# EAGLE design doom-card (EAGLE 9.5.2)
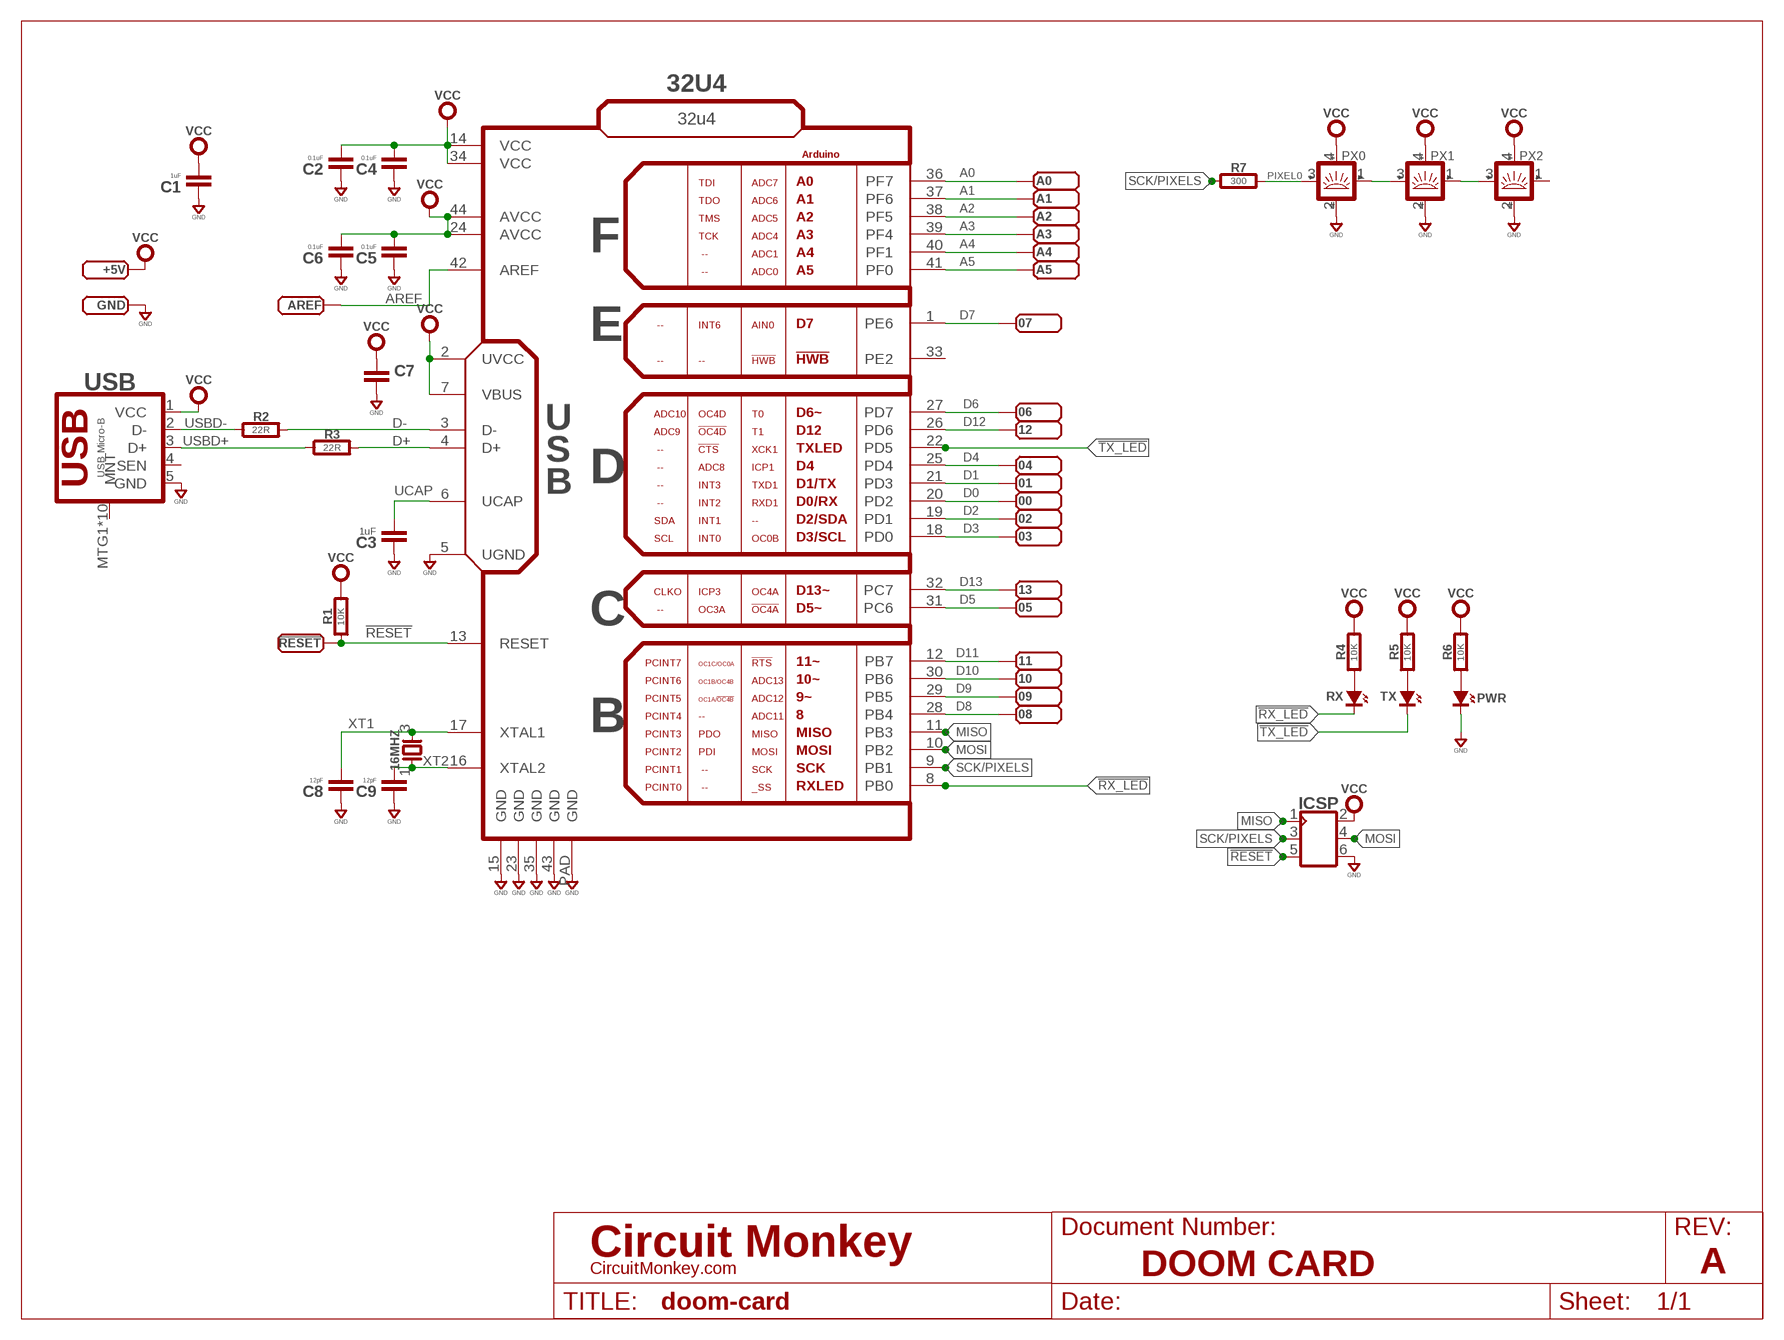
[diagram p0: schematic, sheet 1]
U$1 (LETTER_L-CIRCUITMONKEY): DOCUMENT_NUMBER: DOOM CARD; REV: A

## Parts
00  PADSMD-100X100  [SMD-100X100]
01  PADSMD-100X100  [SMD-100X100]
02  PADSMD-100X100  [SMD-100X100]
03  PADSMD-100X100  [SMD-100X100]
04  PADSMD-100X100  [SMD-100X100]
05  PADSMD-100X100  [SMD-100X100]
06  PADSMD-100X100  [SMD-100X100]
07  PADSMD-100X100  [SMD-100X100]
08  PADSMD-100X100  [SMD-100X100]
09  PADSMD-100X100  [SMD-100X100]
10  PADSMD-100X100  [SMD-100X100]
11  PADSMD-100X100  [SMD-100X100]
12  PADSMD-100X100  [SMD-100X100]
13  PADSMD-100X100  [SMD-100X100]
16MHZ  SMD-4P3X5  [ABRACON_ABM3C]
32U4  32u4  ATMEGA32U4  [QFN50P700X700X100-44]
!RESET  PADSMD-100X100  [SMD-100X100]
+5V  PADSMD-100X100  [SMD-100X100]
A0  PADSMD-100X100  [SMD-100X100]
A1  PADSMD-100X100  [SMD-100X100]
A2  PADSMD-100X100  [SMD-100X100]
A3  PADSMD-100X100  [SMD-100X100]
A4  PADSMD-100X100  [SMD-100X100]
A5  PADSMD-100X100  [SMD-100X100]
AREF  PADSMD-100X100  [SMD-100X100]
C1  1uF  CAPACITOR0402  [0402-CAP]
C2  0.1uF  CAPACITOR0402  [0402-CAP]
C3  1uF  CAPACITOR0402  [0402-CAP]
C4  0.1uF  CAPACITOR0402  [0402-CAP]
C5  0.1uF  CAPACITOR0402  [0402-CAP]
C6  0.1uF  CAPACITOR0402  [0402-CAP]
C7  CAPACITOR0603  [0603-CAP]
C8  12pF  CAPACITOR0402  [0402-CAP]
C9  12pF  CAPACITOR0402  [0402-CAP]
GND  PADSMD-100X100  [SMD-100X100]
ICSP  CON_03X2-VT_SMD  [MA03X2-VT-SMD]
PWR  SMT0402  [SMD_0402]
PX0  SMART_LED3535  [SMD_3535]
PX1  SMART_LED3535  [SMD_3535]
PX2  SMART_LED3535  [SMD_3535]
R1  10K  RESISTOR0402  [0402-RES]
R2  22R  RESISTOR0402  [0402-RES]
R3  22R  RESISTOR0402  [0402-RES]
R4  10K  RESISTOR0402  [0402-RES]
R5  10K  RESISTOR0402  [0402-RES]
R6  10K  RESISTOR0402  [0402-RES]
R7  300  RESISTOR0402  [0402-RES]
RX  SMT0402  [SMD_0402]
TX  SMT0402  [SMD_0402]
USB  USB Micro-B  USB-B-MICRO-SMTJAE-DX4R005  [JAE-DX4R005]

## Nets
!RESET: 32U4.13(RESET) !RESET.PAD ICSP.5 R1.1
!RX_LED: 32U4.8(PB0) RX.K(C)
!TX_LED: 32U4.22(PD5) TX.K(C)
A0: 32U4.36(PF7) A0.PAD
A1: 32U4.37(PF6) A1.PAD
A2: 32U4.38(PF5) A2.PAD
A3: 32U4.39(PF4) A3.PAD
A4: 32U4.40(PF1) A4.PAD
A5: 32U4.41(PF0) A5.PAD
AREF: 32U4.42(AREF) AREF.PAD
D0: 00.PAD 32U4.20(PD2)
D1: 01.PAD 32U4.21(PD3)
D2: 02.PAD 32U4.19(PD1)
D3: 03.PAD 32U4.18(PD0)
D4: 04.PAD 32U4.25(PD4)
D5: 05.PAD 32U4.31(PC6)
D6: 06.PAD 32U4.27(PD7)
D7: 07.PAD 32U4.1(PE6)
D8: 08.PAD 32U4.28(PB4)
D9: 09.PAD 32U4.29(PB5)
D10: 10.PAD 32U4.30(PB6)
D11: 11.PAD 32U4.12(PB7)
D12: 12.PAD 32U4.26(PD6)
D13: 13.PAD 32U4.32(PC7)
D+: 32U4.4(D+) R3.2
D-: 32U4.3(D-) R2.2
GND: 32U4.5(UGND) 32U4.15(GND) 32U4.23(GND) 32U4.35(GND) 32U4.43(GND) 32U4.PAD(GND) C1.1 C2.1 C3.1 C4.1 C5.1 C6.1 C7.2 C8.1 C9.1 GND.PAD ICSP.6 PWR.K(C) PX0.2(GND) PX1.2(GND) PX2.2(GND) USB.5(GND)
MISO: 32U4.11(PB3) ICSP.1
MOSI: 32U4.10(PB2) ICSP.4
N$9: R4.1 RX.A
N$10: R5.1 TX.A
N$11: PWR.A R6.1
N$12: PX0.1(OUT) PX1.3(IN)
N$13: PX1.1(OUT) PX2.3(IN)
PIXEL0: PX0.3(IN) R7.2
SCK/PIXELS: 32U4.9(PB1) ICSP.3 R7.1
UCAP: 32U4.6(UCAP) C3.2
USBD+: R3.1 USB.3(D+)
USBD-: R2.1 USB.2(D-)
VCC: 32U4.2(UVCC) 32U4.7(VBUS) 32U4.14(VCC) 32U4.24(AVCC) 32U4.34(VCC) 32U4.44(AVCC) +5V.PAD C1.2 C2.2 C4.2 C5.2 C6.2 C7.1 ICSP.2 PX0.4(VDD) PX1.4(VDD) PX2.4(VDD) R1.2 R4.2 R5.2 R6.2 USB.1(VCC)
XT1: 16MHZ.3 32U4.17(XTAL1) C8.2
XT2: 16MHZ.1 32U4.16(XTAL2) C9.2
Unconnected: 32U4.33(PE2) PX2.1(OUT) USB.4(SEN) USB.MTG1(MNT) USB.MTG2(MNT) USB.MTG3(MNT) USB.MTG4(MNT) USB.MTG5(MNT) USB.MTG6(MNT) USB.MTG7(MNT) USB.MTG8(MNT) USB.MTG9(MNT) USB.MTG10(MNT)

## Power pins joined to a net without a drawn wire
GND: 16MHZ.2(GND) 16MHZ.4(GND)

## Library data of the parts
00 01-09 10-13 !RESET +5V A0 A1-A5 AREF GND = con-testpoints:PAD: Solder Pad
16MHZ = xtal:SMD-4P
32U4 = atmel-atmega:ATMEGA32U4: ATMEGA 32U4
C1-C9 = rlc:CAPACITOR: Capacitor CAP
ICSP = con-headers:CON_03X2: Header, 3x2 (6-pin)
PWR RX TX = led:SMT: LED SMT
PX0 PX1 PX2 = led:SMART_LED: Smart LED SK6812 WS2812
R1-R7 = rlc:RESISTOR: Resistor
USB = con-usb:USB-B-MICRO-SMT: USB Micro - B-style; MFR: JAE; MPN: DX4R005JJ2R1800; OC_MOUSER: https://www.mouser.com/ProductDetail/DX4R005JJ2R1800

## Board
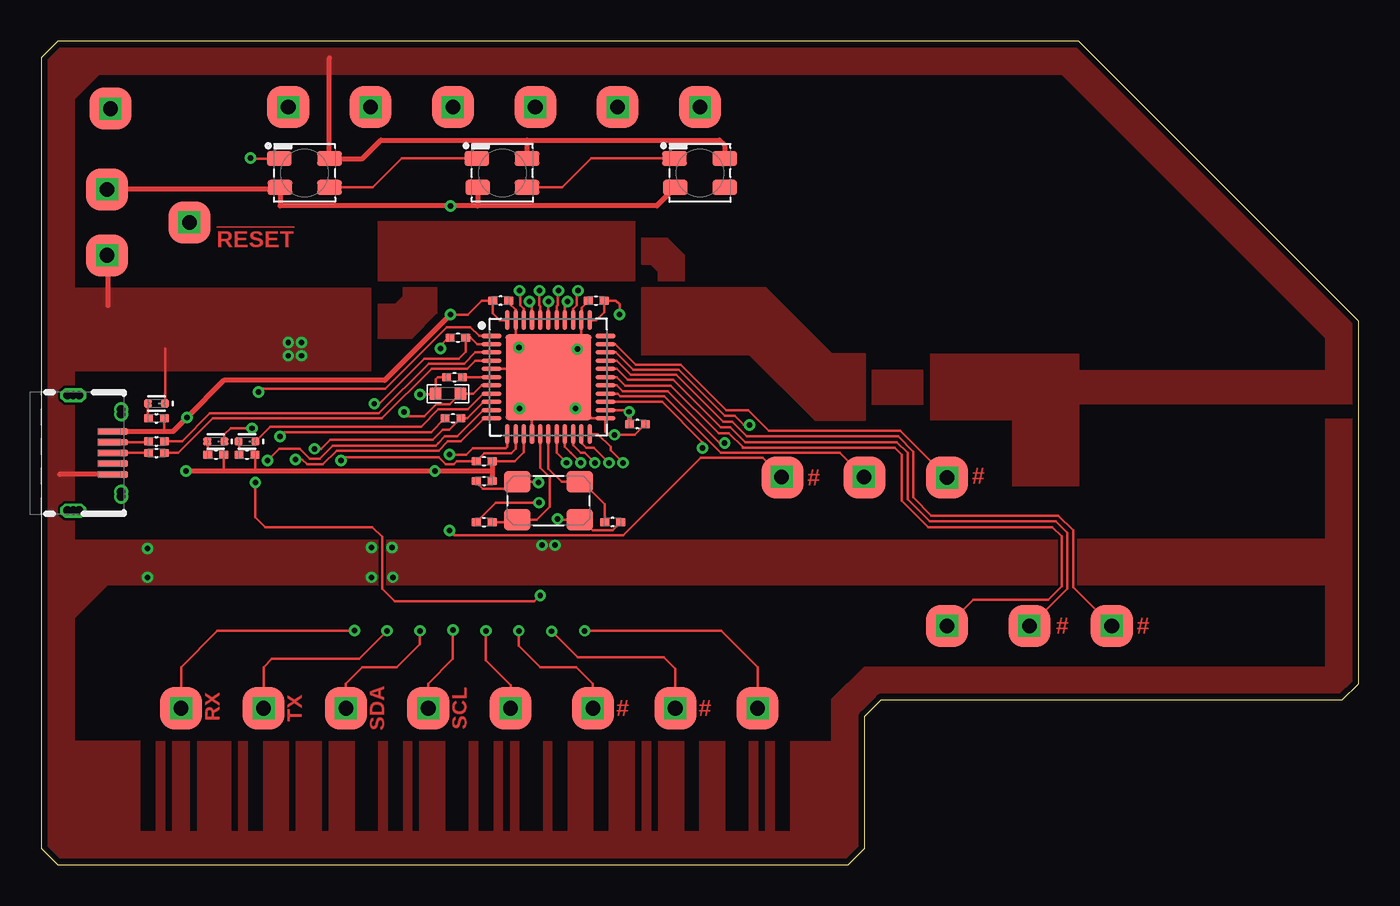
[diagram p1: board, top side]
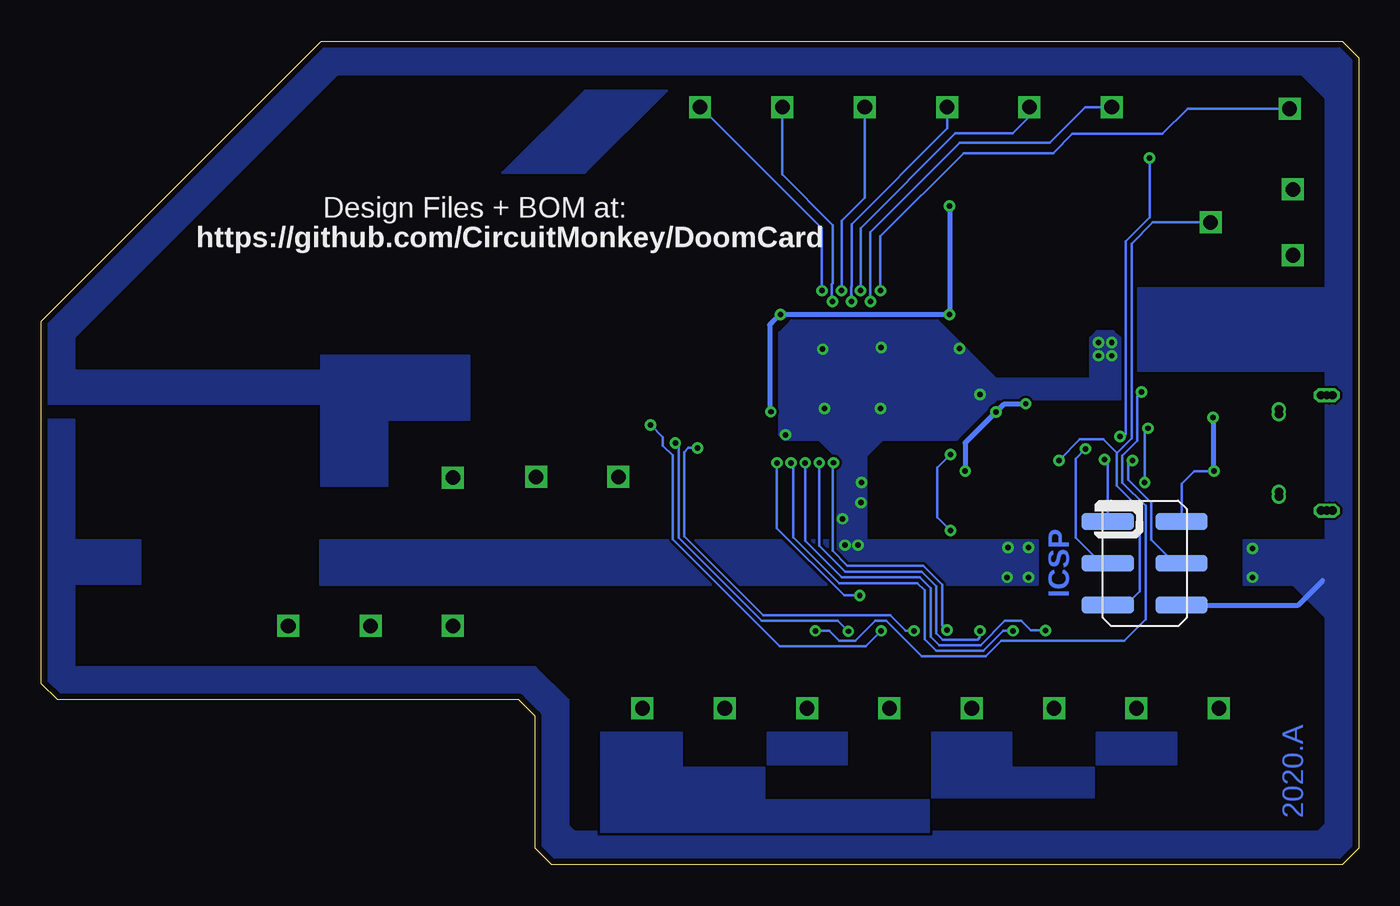
[diagram p2: board, bottom side, seen from below]

Size 80 x 50 mm. Coordinates in mm from the lower left corner, seen from the top.
Outline: 1,0 49,0 50,1 50,9 51,10 79,10 80,11 80,33 63,50 1,50 0,49 0,1 1,0
Copper layers (1*16): Top 0.0356mm / dielectric 1.5011mm / Bottom 0.0356mm
Design rules "OSH-CircuitMonkey": minimum track width 6mil, minimum drill 13mil, track to track 6mil, track to pad 6mil, pad to pad 6mil, via to via 6mil, smd to smd 6mil, copper to edge 15mil, drill to drill 6mil, minimum pad ring 7mil, minimum via ring 7mil, stop-mask expansion 3mil, vias tented up to drill 13mil, thermal gap 10mil

### Footprints (pad centres in the part's own frame; a part is rotated, then mirrored left to right if it is on the bottom)
SMD-100X100 = smd 2.54 x 2.54: PAD 0,0
ABRACON_ABM3C = smd 1.6 x 1.3: 1 -1.9,-1.15; 2 1.9,-1.15; 3 1.9,1.15; 4 -1.9,1.15
QFN50P700X700X100-44 = smd 1.2 x 0.264: 1 -3.46,2.5; 2 -3.46,2; 3 -3.46,1.5; 4 -3.46,1; 5 -3.46,0.5; 6 -3.46,0; 7 -3.46,-0.5; 8 -3.46,-1; 9 -3.46,-1.5; 10 -3.46,-2; 11 -3.46,-2.5; 23 3.46,-2.5; 24 3.46,-2; 25 3.46,-1.5; 26 3.46,-1; 27 3.46,-0.5; 28 3.46,0; 29 3.46,0.5; 30 3.46,1; 31 3.46,1.5; 32 3.46,2; 33 3.46,2.5 | smd 0.264 x 1.2: 12 -2.5,-3.46; 13 -2,-3.46; 14 -1.5,-3.46; 15 -1,-3.46; 16 -0.5,-3.46; 17 0,-3.46; 18 0.5,-3.46; 19 1,-3.46; 20 1.5,-3.46; 21 2,-3.46; 22 2.5,-3.46; 34 2.5,3.46; 35 2,3.46; 36 1.5,3.46; 37 1,3.46; 38 0.5,3.46; 39 0,3.46; 40 -0.5,3.46; 41 -1,3.46; 42 -1.5,3.46; 43 -2,3.46; 44 -2.5,3.46 | smd 5.2 x 5.2: PAD 0,0
0402-CAP = smd 0.559 x 0.508: 1 -0.483,0; 2 0.483,0
0603-CAP = smd 0.711 x 0.762: 1 -0.752,0; 2 0.752,0
MA03X2-VT-SMD = smd 1.016 x 3.175: 1 -2.54,-2.235; 2 -2.54,2.235; 3 0,-2.235; 4 0,2.235; 5 2.54,-2.235; 6 2.54,2.235
SMD_0402 = smd 0.5 x 0.5: A -0.52,0; K 0.52,0
SMD_3535 = smd 1.5 x 0.9: 1 -1.5,0.875; 2 -1.5,-0.875; 3 1.55,-0.875; 4 1.5,0.875
0402-RES = smd 0.559 x 0.508: 1 -0.483,0; 2 0.483,0
JAE-DX4R005 = smd 0.4 x 1.8: 1 -1.3,4.35; 2 -0.65,4.35; 3 0,4.35; 4 0.65,4.35; 5 1.3,4.35 | drill 0.5 octagon: MTG1 -3.5,1.95; MTG2 3.5,1.95; MTG7 -3.5,2.3; MTG8 -3.5,1.6; MTG9 3.5,2.3; MTG10 3.5,1.6 | drill 0.5: MTG3 -2.65,4.85; MTG4 2.65,4.85; MTG5 -2.35,4.85; MTG6 2.35,4.85

### Placement (x,y rotation side)
00  8.5,9.5 270 top
01  13.5,9.5 270 top
02  18.5,9.5 270 top
03  23.5,9.5 270 top
04  28.5,9.5 270 top
05  33.5,9.5 270 top
06  38.5,9.5 270 top
07  43.5,9.5 270 top
08  55,14.5 270 top
09  60,14.5 270 top
10  65,14.5 270 top
11  45,23.5 270 top
12  50,23.5 270 top
13  55,23.5 270 top
16MHZ  30.8,22.1 0 top
32U4  30.8,29.6 0 top
!RESET  9,39 270 top
+5V  4,41 270 top
A0  40,46 270 top
A1  35,46 270 top
A2  30,46 270 top
A3  25,46 270 top
A4  20,46 270 top
A5  15,46 270 top
AREF  4.2,45.9 270 top
C1  25.3,32 0 top
C2  26.9,23.3 0 top
C3  25.1,29.6 0 top
C4  33.7,34.25 0 top
C5  36.2,26.75 180 top
C6  27.9,34.25 180 top
C7  24.7,28.6 180 top
C8  34.7,20.8 180 top
C9  26.9,20.8 0 top
GND  4,37 270 top
ICSP  13,18.3 270 bottom
PWR  7,28 0 top
PX0  16,42 180 top
PX1  28,42 180 top
PX2  40,42 180 top
R1  26.9,24.5 0 top
R2  7,25.7 0 top
R3  7,25 0 top
R4  12.5,24.9 0 top
R5  10.6,24.9 0 top
R6  7,27.1 0 top
R7  25,27.1 180 top
RX  12.5,25.7 0 top
TX  10.6,25.7 0 top
USB  0,25 270 top

### Tracks (layer width: path | path; a pad name or v marks a point on that pad's centre or on a via)
!RESET  (via drill 0.33, 0.89)
  Top 0.152: 32U4.13 28.8,25.25 28.53,24.98 26.9,24.98 R1.1 25.22,24.5 25.04,24.32 24.56,24.32 24.13,24.75 18.4,24.75 v18.2,24.55
  Bottom 0.152: 14.7,24.99 14.7,23 13.3,21.6 13.3,16.6 14.14,15.76 ICSP.5 | !RESET.PAD 12.5,39 13.8,37.7 13.8,25.89 14.7,24.99 | v18.2,24.55 v18.2,24.56 16.94,25.82 15.51,25.82 14.7,25.01 14.7,24.99
  other vias: 9,39
!RX_LED
  Top 0.152: 32U4.8 26.84,28.6 25.9,27.66 24.12,27.66 23.06,26.6 13.9,26.6 13.02,25.72 RX.K
!TX_LED  (via drill 0.33)
  Top 0.152: v35.33,24.4 34.58,25.15 34.58,25.36 33.81,26.14 32U4.22 | v30.3,16.35 29.95,16 21.47,16 20.7,16.77 20.7,19.9 20.1,20.5 13.6,20.5 13,21.1 v13,23.2 | v12.8,26.5 11.5,26.5 11.12,26.12 TX.K
  Bottom 0.152: v35.33,24.4 35.33,20.43 31.25,16.35 v30.3,16.35 | v12.8,26.5 13,26.3 v13,23.2
A0  (via drill 0.33, 0.89)
  Top 0.152: 32U4.36 32.3,33.74 32.52,33.96 32.52,34.85 v32.6,34.85
  Bottom 0.152: A0.PAD 39.95,46 32.6,38.65 v32.6,34.85
  other vias: 40,46
A1  (via drill 0.33, 0.89)
  Top 0.152: 32U4.37 31.8,34.05 v31.95,34.2
  Bottom 0.152: v31.95,34.2 31.95,34.3 32,34.35 32,35.24 31.93,35.31 31.93,38.84 35,41.91 A1.PAD
  other vias: 35,46
A2  (via drill 0.33, 0.89)
  Top 0.152: 32U4.38 31.3,33.89 31.37,33.96 31.37,34.82 v31.4,34.85
  Bottom 0.152: A2.PAD 30,40.5 31.4,39.1 v31.4,34.85
  other vias: 30,46
A3  (via drill 0.33, 0.89)
  Top 0.152: 32U4.39 v30.8,34.2
  Bottom 0.152: A3.PAD 25,44.7 30.8,38.9 30.8,35.11 30.82,35.09 30.82,34.61 30.8,34.59 v30.8,34.2
  other vias: 25,46
A4  (via drill 0.33, 0.89)
  Top 0.152: 32U4.40 30.3,33.89 30.23,33.96 30.23,34.44 30.25,34.46 v30.25,34.85
  Bottom 0.152: v30.25,34.85 30.25,38.65 24.5,44.4 21,44.4 20,45.4 A4.PAD
  other vias: 20,46
A5  (via drill 0.33, 0.89)
  Top 0.152: 32U4.41 29.8,34.05 v29.65,34.2
  Bottom 0.152: v29.65,34.2 29.65,38.41 24.24,43.82 18.78,43.82 16.6,46 A5.PAD
  other vias: 15,46
AAA
  pour Bottom: 11.1,8 11.1,6.1 15.9,6.1 15.9,8
  pour Bottom: 21.1,8 21.1,6 25.9,6 25.9,8
  pour Bottom: 31.1,8 31.1,6.1 35.9,6.1 35.9,8
  pour Bottom: 41.1,8 41.1,6 46,6 46,8
  pour Bottom: 16.1,5.9 16.1,4.1 25.9,4.1 25.9,5.9
  pour Bottom: 36.1,5.9 36.1,4 46,4 46,5.9
  pour Bottom: 26.1,3.9 26.1,2 46,2 46,3.9
AREF  (via drill 0.33, 0.89)
  Top 0.152: 32U4.42 29.3,33.74 29.08,33.96 29.08,34.82 v29.05,34.85
  Bottom 0.152: AREF.PAD 10.4,45.9 11.93,44.37 17.39,44.37 18.56,43.2 24,43.2 29.05,38.15 v29.05,34.85
  other vias: 4.2,45.9
D0  (via drill 0.33, 0.89)
  Top 0.152: v19.02,14.22 19,14.2 10.7,14.2 8.5,12 00.PAD | v33.62,24.4 33,25.01 32.75,25.01 32.3,25.46 32U4.20
  Bottom 0.152: v33.62,24.4 33.62,19.67 31.4,17.45 26.67,17.45 26,16.78 26,13.85 25.47,13.32 22.97,13.32 21.49,14.8 20.5,14.8 19.92,14.22 v19.02,14.22
  other vias: 8.5,9.5
D1  (via drill 0.33, 0.89)
  Top 0.152: 01.PAD 13.5,12 14,12.5 19.3,12.5 v21,14.2 | 32U4.21 32.84,26.1 32.84,25.57 33.1,25.31 33.56,25.31 v34.47,24.4
  Bottom 0.152: v34.47,24.4 34.32,24.25 34.32,19.87 31.55,17.1 26.8,17.1 26.35,16.65 26.35,13.7 25.65,13 22.8,13 21.6,14.2 v21,14.2
  other vias: 13.5,9.5
D2  (via drill 0.33, 0.89)
  Top 0.152: 02.PAD 18.5,11 19.5,12 21.6,12 23,13.4 v23,14.2 | 32.15,25.01 | 32.15,25.01 v32.76,24.41 | 32U4.19 31.8,25.36 32.15,25.01
  Bottom 0.152: v32.76,24.41 32.76,19.38 31.18,17.8 26.55,17.8 25.65,16.9 25.65,14.05 25.25,13.65 23.15,13.65 23,13.8 v23,14.2
  other vias: 18.5,9.5
D3  (via drill 0.33, 0.89)
  Top 0.152: 03.PAD 23.5,11 25,12.5 v25,14.25 | 32U4.18 31.3,25 v31.9,24.41
  Bottom 0.152: v31.9,24.41 31.95,24.36 31.95,19.05 31.05,18.15 26.45,18.15 25.3,17 25.3,14.55 v25,14.25
  other vias: 23.5,9.5
D4  (via drill 0.33, 0.89)
  Top 0.152: 04.PAD 28.5,10.9 27,12.4 v27,14.2 | 32U4.25 37.7,28.1 40.15,25.65 v40.15,25.3
  Bottom 0.152: v27,14.2 27.5,14.2 28.45,15.15 36.15,15.15 40.95,19.95 40.95,25.05 40.7,25.3 v40.15,25.3
  other vias: 28.5,9.5
D5  (via drill 0.33, 0.89)
  Top 0.152: v29,14.2 29,13.3 30.3,12 32.5,12 33.5,11 05.PAD | 32U4.31 34.9,31.1 35.95,30.05 38.2,30.05 38.7,30.05 41.5,27.25 42.1,27.25 42.65,26.7 v43,26.7
  Bottom 0.152: v29,14.2 29.95,13.25 35.15,13.25 41.65,19.75 41.65,24.85 42.25,25.45 42.25,25.95 v43,26.7
  other vias: 33.5,9.5
D6  (via drill 0.33, 0.89)
  Top 0.152: 06.PAD 38.5,11.9 37.8,12.6 32.57,12.6 v31,14.17 | 32U4.27 34.96,29.1 35.3,28.76 38.04,28.76 41.2,25.6 v41.5,25.6
  Bottom 0.152: v31,14.17 31.62,14.8 36.25,14.8 41.3,19.85 41.3,25.4 v41.5,25.6
  other vias: 38.5,9.5
D7  (via drill 0.33, 0.89)
  Top 0.152: 07.PAD 43.5,12 41.3,14.2 v33,14.2 | 32U4.1 26.59,32.1 26.06,32.63 24.63,32.63 20.9,28.9 13.41,28.9 v13.2,28.69
  Bottom 0.152: v13.2,28.69 13.45,28.44 13.45,25.74 14.35,24.84 14.35,23.2 12.95,21.8 12.95,14.9 14.25,13.6 21.7,13.6 22.65,12.65 26.55,12.65 28.7,14.8 29.36,14.8 30.56,13.6 31.55,13.6 32.15,14.2 v33,14.2
  other vias: 43.5,9.5
D8  (via drill 0.89)
  Top 0.152: 32U4.28 34.96,29.6 35.47,29.09 38.24,29.09 41.13,26.2 41.75,26.2 42.61,25.34 42.6,25.32 51.82,25.32 52.25,24.89 52.25,22.1 53.85,20.5 61.4,20.5 61.95,19.95 61.95,16.9 61.15,16.1 56.6,16.1 08.PAD
  other vias: 55,14.5
D9  (via drill 0.89)
  Top 0.152: 32U4.29 34.96,30.1 35.63,29.43 38.38,29.43 41.26,26.55 41.85,26.55 42.75,25.65 51.95,25.65 52.6,25 52.6,22.2 53.95,20.85 61.6,20.85 62.3,20.15 62.3,16.75 60.05,14.5 09.PAD
  other vias: 60,14.5
D10  (via drill 0.89)
  Top 0.152: 32U4.30 34.96,30.6 35.81,29.75 38.07,29.75 38.55,29.75 41.4,26.9 41.95,26.9 42.85,26 52.03,26 52.95,25.08 52.95,22.3 54.05,21.2 61.74,21.2 62.65,20.29 62.65,16.85 10.PAD
  other vias: 65,14.5
D11  (via drill 0.33, 0.89)
  Top 0.152: 32U4.12 28.3,25.39 28.2,25.29 26.19,25.29 25.8,24.9 v24.8,24.9 | v24.8,20.3 24.8,20.27 25.07,20 35.35,20 40.05,24.7 43.8,24.7 v44.95,23.55 11.PAD
  Bottom 0.152: v24.8,24.9 25.6,24.1 25.6,21.1 v24.8,20.3
D12  (via drill 0.89)
  Top 0.152: 32U4.26 35.01,28.6 35.16,28.45 37.83,28.45 41.26,25.02 48.48,25.02 v49.95,23.55 12.PAD
D13  (via drill 0.89)
  Top 0.152: 32U4.32 34.85,31.6 36.09,30.36 38.83,30.36 41.6,27.6 42.92,27.6 44.17,26.35 52.15,26.35 13.PAD
  other vias: 55,23.5
D+
  Top 0.152: 32U4.4 26.34,30.6 25.86,30.12 23.71,30.12 20.69,27.09 10.43,27.09 8.33,25 R3.2
D-
  Top 0.152: 32U4.3 26.36,31.1 25.69,30.43 23.53,30.43 20.5,27.41 10.24,27.41 8.56,25.72 7.5,25.72 R2.2
GND  (via drill 0.33, 0.89)
  Top 0.152: v31.35,21 31.55,21 31.55,20.95 16MHZ.2 32.92,20.73 33.08,20.73 33.49,20.32 34.7,20.32 C8.1 | v30.2,23.2 30.05,23.2 30,23.25 16MHZ.4 28.47,22.82 26.8,22.82 26.42,23.2 C2.1 | 32U4.15 29.8,27.9 | 32U4.PAD 32.45,27.95 v32.45,27.7 33.05,27.1 32U4.23 34.26,26.3 34.46,26.1 v34.8,26.1 36.03,26.1 C5.1 | 32U4.PAD v29,31.4 28.86,31.4 28.8,31.46 32U4.43 28.8,33.68 28.38,34.1 C6.1 | C4.1 33.22,34.2 32.82,33.81 32.82,33.08 32U4.35 32.8,31.55 v32.55,31.3 | C1.1 24.72,32 24.25,31.53 v24.25,31.35 | v23,28.55 23.9,28.55 C7.2 23.95,29.48 24.07,29.6 C3.1 | 32U4.5 30.3,30.1 32U4.PAD | PWR.K 7.52,31.33 | C9.1 27.6,21.98 v30.22,21.98
  Top 0.305: PX2.2 41.5,43.67 41.17,44 29.5,44 | 29.5,44 20.62,44 19.5,42.88 PX0.2 17.5,48.96 | PX1.2 29.5,44 | USB.5 1.1,23.7 | GND.PAD 4.05,36.95 4.05,33.95 | 29.8,27.9 29.25,27.9 v29.05,27.7
  Bottom 0.305: ICSP.6 3.69,15.76 2.2,17.25
  other vias: 30.4,19.4 31.2,19.4 15,31.7 15.8,31.7 15.8,30.9 15,30.9 6.45,19.2 6.45,17.45 21.3,19.25 21.35,17.45 20.05,17.45 20.05,19.25 4,37
  pour Top: 49,0 50,1 50,9 51,10 79,10 80,11 80,27.05 78,27.05 78,19.75 62.9,19.75 62.9,17 78,17 78,12 50,12 48,10 48,2 2,2 2,15 4,17 61.7,17 61.7,19.7 2,19.7 2,30 20,30 20,35 2,35 2,46.5 3.5,48 62,48 78,32 78,30 63,30 63,31 54,31 54,27 59,27 59,23 63,23 63,28 80,28 80,33 63,50 0,50 0,1 1,0
  pour Bottom (rank 5): 49,0 50,1 50,9 51,10 79,10 80,11 80,27 78,27 78,19.7 74,19.7 74,17.05 78,17.05 78,12 50,12 48,10 48,2.4 47.6,2 2.5,2 2,2.5 2,15 4,17 7,17 7,19.7 2,19.7 2,30 13.4,30 13.4,35 2,35 2,46.5 3.5,48 62,48 78,32 78,30 63,30 63,30.9 54,30.9 54,27 59,27 59,23 63,23 63,28 80,28 80,33 63,50 1,50 0,49 0,1 1,0
  pour Top: 6,2 6,7.5 2,7.5 2,2
  pour Top: 7,2 7,7.5 7.5,7.5 7.5,2
  pour Top: 8,2 8,7.5 9,7.5 9,2
  pour Top: 9.5,2 9.5,7.5 11.5,7.5 11.5,2
  pour Top: 12,2 12,7.5 12.5,7.5 12.5,2
  pour Top: 13.5,2 13.5,7.5 15,7.5 15,2
  pour Top: 15.5,2 15.5,7.5 17,7.5 17,2
  pour Top: 17.5,2 17.5,7.5 19,7.5 19,2
  pour Top: 20.5,2 20.5,7.5 21,7.5 21,2
  pour Top: 22,2 22,7.5 22.5,7.5 22.5,2
  pour Top: 23,2 23,7.5 24.5,7.5 24.5,2
  pour Top: 26,2 26,7.5 26.5,7.5 26.5,2
  pour Top: 27.5,2 27.5,7.5 28,7.5 28,2
  pour Top: 28.5,2 28.5,7.5 29,7.5 29,2
  pour Top: 30.5,2 30.5,7.5 31,7.5 31,2
  pour Top: 32,2 32,7.5 33.5,7.5 33.5,2
  pour Top: 34.5,2 34.5,7.5 36,7.5 36,2
  pour Top: 36.5,2 36.5,7.5 37,7.5 37,2
  pour Top: 37.5,2 37.5,7.5 39,7.5 39,2
  pour Top: 40,2 40,7.5 41.5,7.5 41.5,2
  pour Top: 43,2 43,7.5 43.5,7.5 43.5,2
  pour Top: 44,2 44,7.5 44.5,7.5 44.5,2
  pour Top: 45.5,2 45.5,7.5 48,7.5 48,2
  pour Bottom: 33.9,33.6 35.2,32.3 35.2,26.1 34.9,25.8 32.8,25.8 31.8,24.8 31.8,19.5 31.35,19.05 30.3,19.05 29.9,19.45 29.9,24.8 28.9,25.8 24.4,25.8 21.95,28.25 14.5,28.25 14.5,32 14.9,32.4 15.9,32.4 16.3,32 16.3,29.55 16.35,29.5 22,29.5 26.1,33.6
  pour Bottom: 19.5,19.7 19.5,17 21.95,17 21.95,19.7
  pour Bottom: 22,19.7 22,17 63.05,17 63.05,19.7
MISO  (via drill 0.33)
  Top 0.152: 32U4.11 26.89,27.1 25.49,25.7 24.69,25.7 24.14,25.14 17.94,25.14 17.1,24.3 16.15,24.3 15.85,24.6 v15.45,24.6
  Bottom 0.152: v15.45,24.6 15.23,24.39 ICSP.1
MOSI  (via drill 0.33)
  Top 0.152: 32U4.10 27.33,27.61 26.87,27.61 25.26,26 24.5,26 24.09,25.59 23.96,25.45 17.7,25.45 16.9,24.65 16.3,24.65 15.7,25.25 14.45,25.25 v13.75,24.55
  Bottom 0.152: v13.75,24.55 14,24.3 14,23.38 12.6,21.98 12.6,19.73 11.16,18.3 ICSP.4
N$1
  pour Bottom: 52,42 47,47 42,47 47,42
N$9
  Top 0.152: RX.A 12.02,25.66 R4.1
N$10
  Top 0.152: TX.A 10.12,25.66 R5.1
N$11
  Top 0.152: R6.1 6.48,27.14 PWR.A
N$12
  Top 0.152: PX0.1 20.12,41.12 21.9,42.9 26.43,42.9 PX1.3
N$13
  Top 0.152: PX1.1 31.62,41.12 33.4,42.9 38.42,42.9 PX2.3
N$17
  pour Top: 36,35.5 36,39 20.5,39 20.5,35.5
N$18
  pour Top: 50,31 48,31 44,35 36.5,35 36.5,31 43,31 47,27 50,27
N$19
  pour Top: 36.5,38 38,38 39,37 39,35.5 37.5,35.5 37.5,36 37,36.5 36.5,36.5
N$20
  pour Top: 50.5,30 53.5,30 53.5,28 50.5,28
N$21
  pour Top: 22,35 24,35 24,33.5 22.5,32 20.5,32 20.5,34 21.5,34 22,34.5
PIXEL0  (via drill 0.33)
  Top 0.152: PX0.3 12.72,42.88 v12.7,42.9 | v14.5,26 14.76,26.25 23.67,26.25 R7.2
  Bottom 0.152: v12.7,42.9 12.7,39.3 14.15,37.85 14.15,26.15 14.3,26 v14.5,26
SCK/PIXELS  (via drill 0.33)
  Top 0.152: 32U4.9 26.86,28.1 25.86,27.1 R7.1 24.79,26.41 24.37,26.41 23.77,25.8 17.55,25.8 17,25.25 v16.6,25.25
  Bottom 0.152: ICSP.3 15.63,18.3 17.2,19.86 17.19,24.66 v16.6,25.25
UCAP
  Top 0.152: 32U4.6 C3.2
USBD+
  Top 0.152: USB.3 R3.1
USBD-
  Top 0.152: USB.2 6.47,25.65 R2.1
VCC  (via drill 0.33, 0.89)
  Top 0.152: 32U4.7 26.74,29.1 26.24,28.6 C7.1 24.82,27.96 24,27.96 23.27,27.24 22.27,27.24 v22.02,27.49 | 32U4.2 26.48,31.6 26.08,32 C1.2 25.78,31.15 25.36,30.73 23.25,30.73 20.52,28 20.23,28 v20.22,27.99 | R1.2 28.75,24.5 29.3,25.05 32U4.14 | 32U4.34 33.69,33.06 34.18,33.55 C4.2 34.88,34.25 35.12,34.02 v35.12,33.4 | 32U4.44 27.85,33.06 27.42,33.49 C6.2 26.75,34.25 25.9,33.4 v24.85,33.4 | 32U4.24 35.6,27.6 v35.7,27.5 | R6.2 7.48,26.32 7.5,26.3 | R5.2 11.08,23.93 11.05,23.9 | R4.2 12.98,23.93 12.95,23.9
  Top 0.305: USB.1 7.5,26.3 8,26.3 v8.85,27.15 11.1,29.4 20.85,29.4 v24.85,33.4 | R1.2 27.38,23.9 | 27.38,23.9 C2.2 | PX2.4 37.38,40 26.5,40 | 26.5,40 v24.85,40 14.5,40 14.5,41 | 14.5,41 +5V.PAD | PX1.4 26.5,40 | PX0.4 14.5,41 | 27.38,23.9 v23.9,23.9 12.95,23.9 11.05,23.9 v8.8,23.9 | C5.2 35.7,26.77 v35.7,27.5
  Bottom 0.152: v8.8,23.9 10.01,23.9 10.77,23.14 ICSP.2
  Bottom 0.305: v23.9,23.9 23.9,25.61 v22.02,27.49 21.52,27.99 v20.22,27.99 | v8.85,27.15 8.85,23.95 v8.8,23.9 | v35.7,27.5 35.77,27.57 35.77,32.78 35.65,32.9 v35.12,33.4 35.07,33.41 24.85,33.41 v24.85,33.4 v24.85,40
  other vias: 4,41
XT1
  Top 0.152: 32U4.17 30.8,24.05 31.6,23.25 16MHZ.3 32.85,23.25 34.22,21.88 C8.2
XT2
  Top 0.152: 32U4.16 30.3,24.1 30.87,23.53 30.87,21.72 30.1,20.95 16MHZ.1 28.75,20.8 C9.2

### Text on the board
Top: # | # | # | # | RX | TX | SDA | SCL | # | #
Bottom: 2020.A
bPlace: Design Files + BOM at: | https://github.com/CircuitMonkey/DoomCard
bStop: Arduino Leonardo compatible / when components present.
bRestrict: D e s i g n e d b y M a r k J K o c h